# Altium schematic sheet User Interfaces.SchDoc
size A4; Organization: TESLA Motors, INC; Address1: 3500 Deer Creek Road; Address2: Palo Alto, CA; Address4: U.S.A.; SheetNumber: 19; SheetTotal: 21
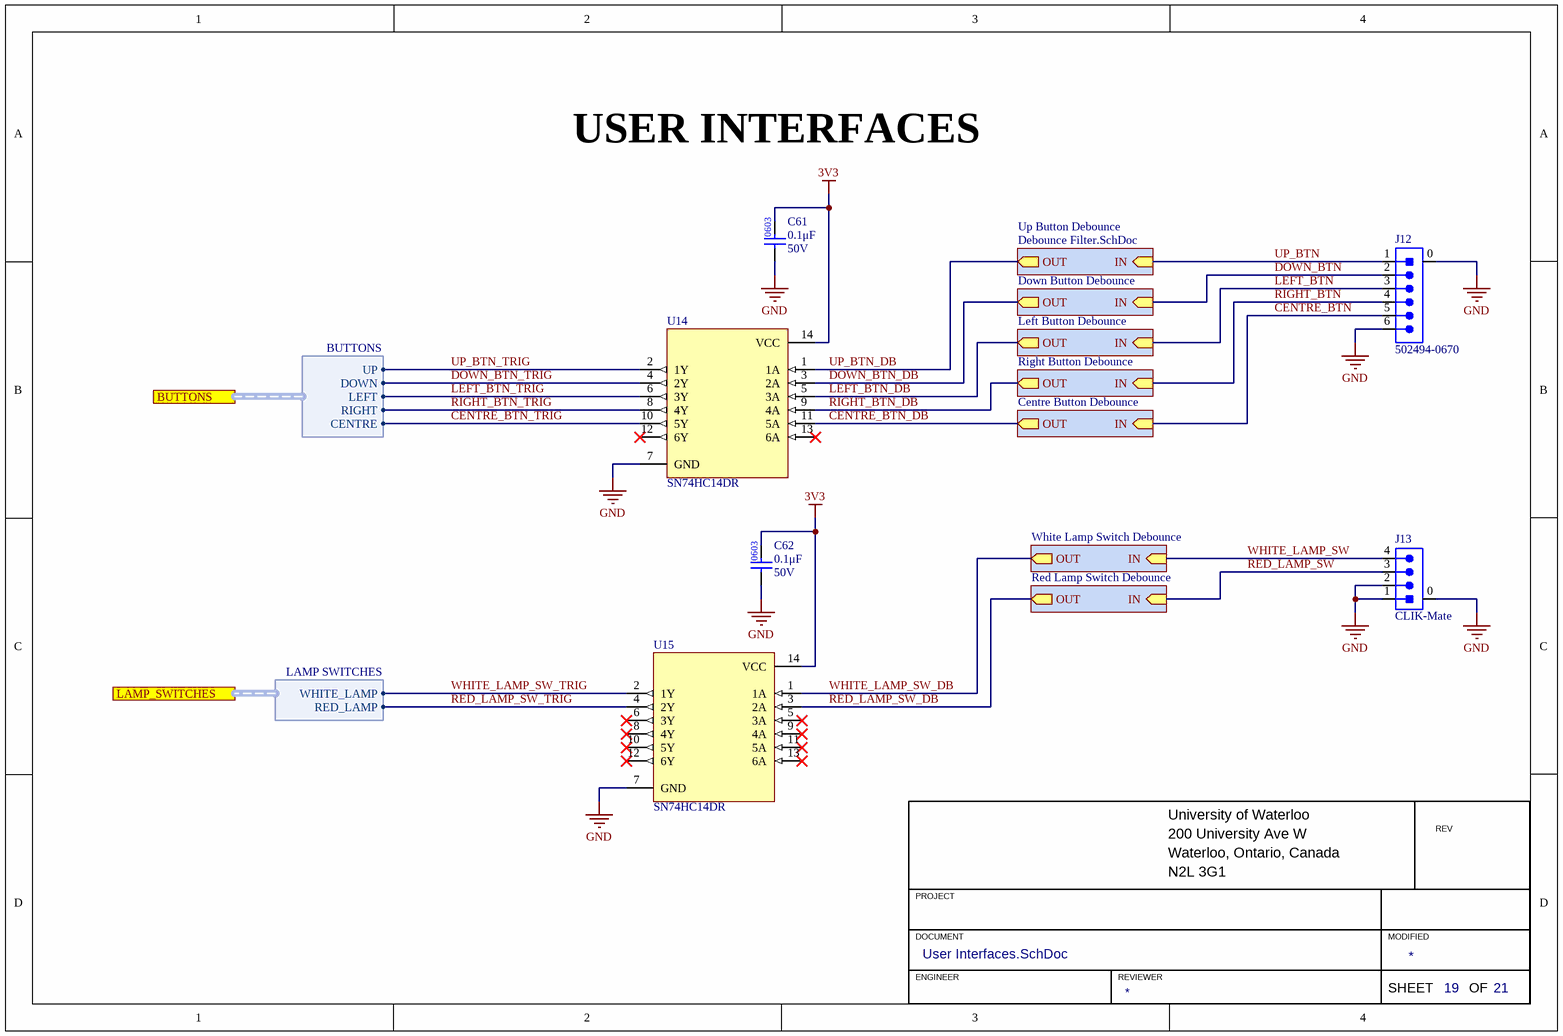
[diagram p0: User Interfaces.SchDoc]

## Parts
C61  value 0.1μF  Voltage Rating: 50V  [CAP0603]  (hidden comment: CAP_0.1uF_50V_0603)
C62  value 0.1μF  Voltage Rating: 50V  [CAP0603]  (hidden comment: CAP_0.1uF_50V_0603)
J12  Manufacturer Part Number 1: 502494-0670  [MOLEX-5024940670]  (hidden comment: CON_6M_SM_RA)
J13  Family: CLIK-Mate  [MOLEX-5025850470]  (hidden comment: CON_4M_SM_RA)
U14  SN74HC14DR  [TI_14-SOIC]
U15  SN74HC14DR  [TI_14-SOIC]

## Sub-sheets
Centre Button Debounce = Debounce Filter.SchDoc: IN (in), OUT (out)
Down Button Debounce = Debounce Filter.SchDoc: IN (in), OUT (out)
Left Button Debounce = Debounce Filter.SchDoc: IN (in), OUT (out)
Red Lamp Switch Debounce = Debounce Filter.SchDoc: IN (in), OUT (out)
Right Button Debounce = Debounce Filter.SchDoc: IN (in), OUT (out)
Up Button Debounce = Debounce Filter.SchDoc: IN (in), OUT (out)
White Lamp Switch Debounce = Debounce Filter.SchDoc: IN (in), OUT (out)

## Ports
BUTTONS (harness BUTTONS), LAMP_SWITCHES (harness LAMP SWITCHES)

## Harnesses
BUTTONS: UP, DOWN, LEFT, RIGHT, CENTRE
LAMP SWITCHES: WHITE_LAMP, RED_LAMP

## Nets
3V3: C61.2 C62.2 U14.14(VCC) U15.14(VCC)
GND: C61.1 C62.1 J12.0 J12.6 J13.0 J13.1 J13.2 U14.7(GND) U15.7(GND)
CENTRE_BTN: J12.5 ; sheet Centre Button Debounce/IN
CENTRE_BTN_DB: U14.11(5A) ; sheet Centre Button Debounce/OUT
CENTRE_BTN_TRIG: U14.10(5Y) ; port BUTTONS.CENTRE
DOWN_BTN: J12.2 ; sheet Down Button Debounce/IN
DOWN_BTN_DB: U14.3(2A) ; sheet Down Button Debounce/OUT
DOWN_BTN_TRIG: U14.4(2Y) ; port BUTTONS.DOWN
LEFT_BTN: J12.3 ; sheet Left Button Debounce/IN
LEFT_BTN_DB: U14.5(3A) ; sheet Left Button Debounce/OUT
LEFT_BTN_TRIG: U14.6(3Y) ; port BUTTONS.LEFT
RED_LAMP_SW: J13.3 ; sheet Red Lamp Switch Debounce/IN
RED_LAMP_SW_DB: U15.3(2A) ; sheet Red Lamp Switch Debounce/OUT
RED_LAMP_SW_TRIG: U15.4(2Y) ; port LAMP_SWITCHES.RED_LAMP
RIGHT_BTN: J12.4 ; sheet Right Button Debounce/IN
RIGHT_BTN_DB: U14.9(4A) ; sheet Right Button Debounce/OUT
RIGHT_BTN_TRIG: U14.8(4Y) ; port BUTTONS.RIGHT
UP_BTN: J12.1 ; sheet Up Button Debounce/IN
UP_BTN_DB: U14.1(1A) ; sheet Up Button Debounce/OUT
UP_BTN_TRIG: U14.2(1Y) ; port BUTTONS.UP
WHITE_LAMP_SW: J13.4 ; sheet White Lamp Switch Debounce/IN
WHITE_LAMP_SW_DB: U15.1(1A) ; sheet White Lamp Switch Debounce/OUT
WHITE_LAMP_SW_TRIG: U15.2(1Y) ; port LAMP_SWITCHES.WHITE_LAMP

Not connected (* = marked no-connect by the designer): U14 12(6Y)* 13(6A)*; U15 5(3A)* 6(3Y)* 8(4Y)* 9(4A)* 10(5Y)* 11(5A)* 12(6Y)* 13(6A)*

## Notes on the sheet
- USER INTERFACES
- University of Waterloo
- 200 University Ave W
- REV
- PROJECT
- Waterloo, Ontario, Canada
- N2L 3G1
- DOCUMENT
- ENGINEER
- REVIEWER
- MODIFIED
- SHEET
- OF

## Library data of the parts
C61 C62 = CAP_0.1uF_50V_0603: CAP CER 0.1UF 50V X7R 0603; Manufacturer 1: Yageo; Manufacturer Part Number 1: CC0603KRX7R9BB104; Package/Footprint: 0603; Supplier 1: Digi-Key; Supplier Part Number 1: 311-1344-1-ND; Mounting Type: SMD; Dielectric: X7R
J12 = CON_6M_SM_RA: CONN HEADER SMD RIGHT ANGLE 2MM PITCH; Manufacturer 1: Molex; Current Rating: 3A; Voltage Rating: 250V; Supplier 1: Digi-Key; Orientation: Right Angle; Pitch: 2mm; Supplier Part Number 1: WM2283CT-ND
J13 = CON_4M_SM_RA: CONN HEADER SMD RIGHT ANGLE 1.5 MM PITCH; Supplier 1: Digi-Key; Supplier Part Number 1: WM9449CT-ND; Package/Footprint: SMD; Mounting Type: SMD
U14 U15 = SN74HC14DR: IC INVERT SCHMITT 6CH 1IN 14SOIC; Manufacturer 1: Texas Instruments; Package/Footprint: 14-SOIC; Manufacturer Part Number 1: SN74HC14DR; Supplier 1: Digikey; Supplier Part Number 1: 296-1194-1-ND